# Altium schematic sheet Power_schematic.SchDoc
size 420 x 297 mm; SheetNumber: 1; SheetTotal: 4
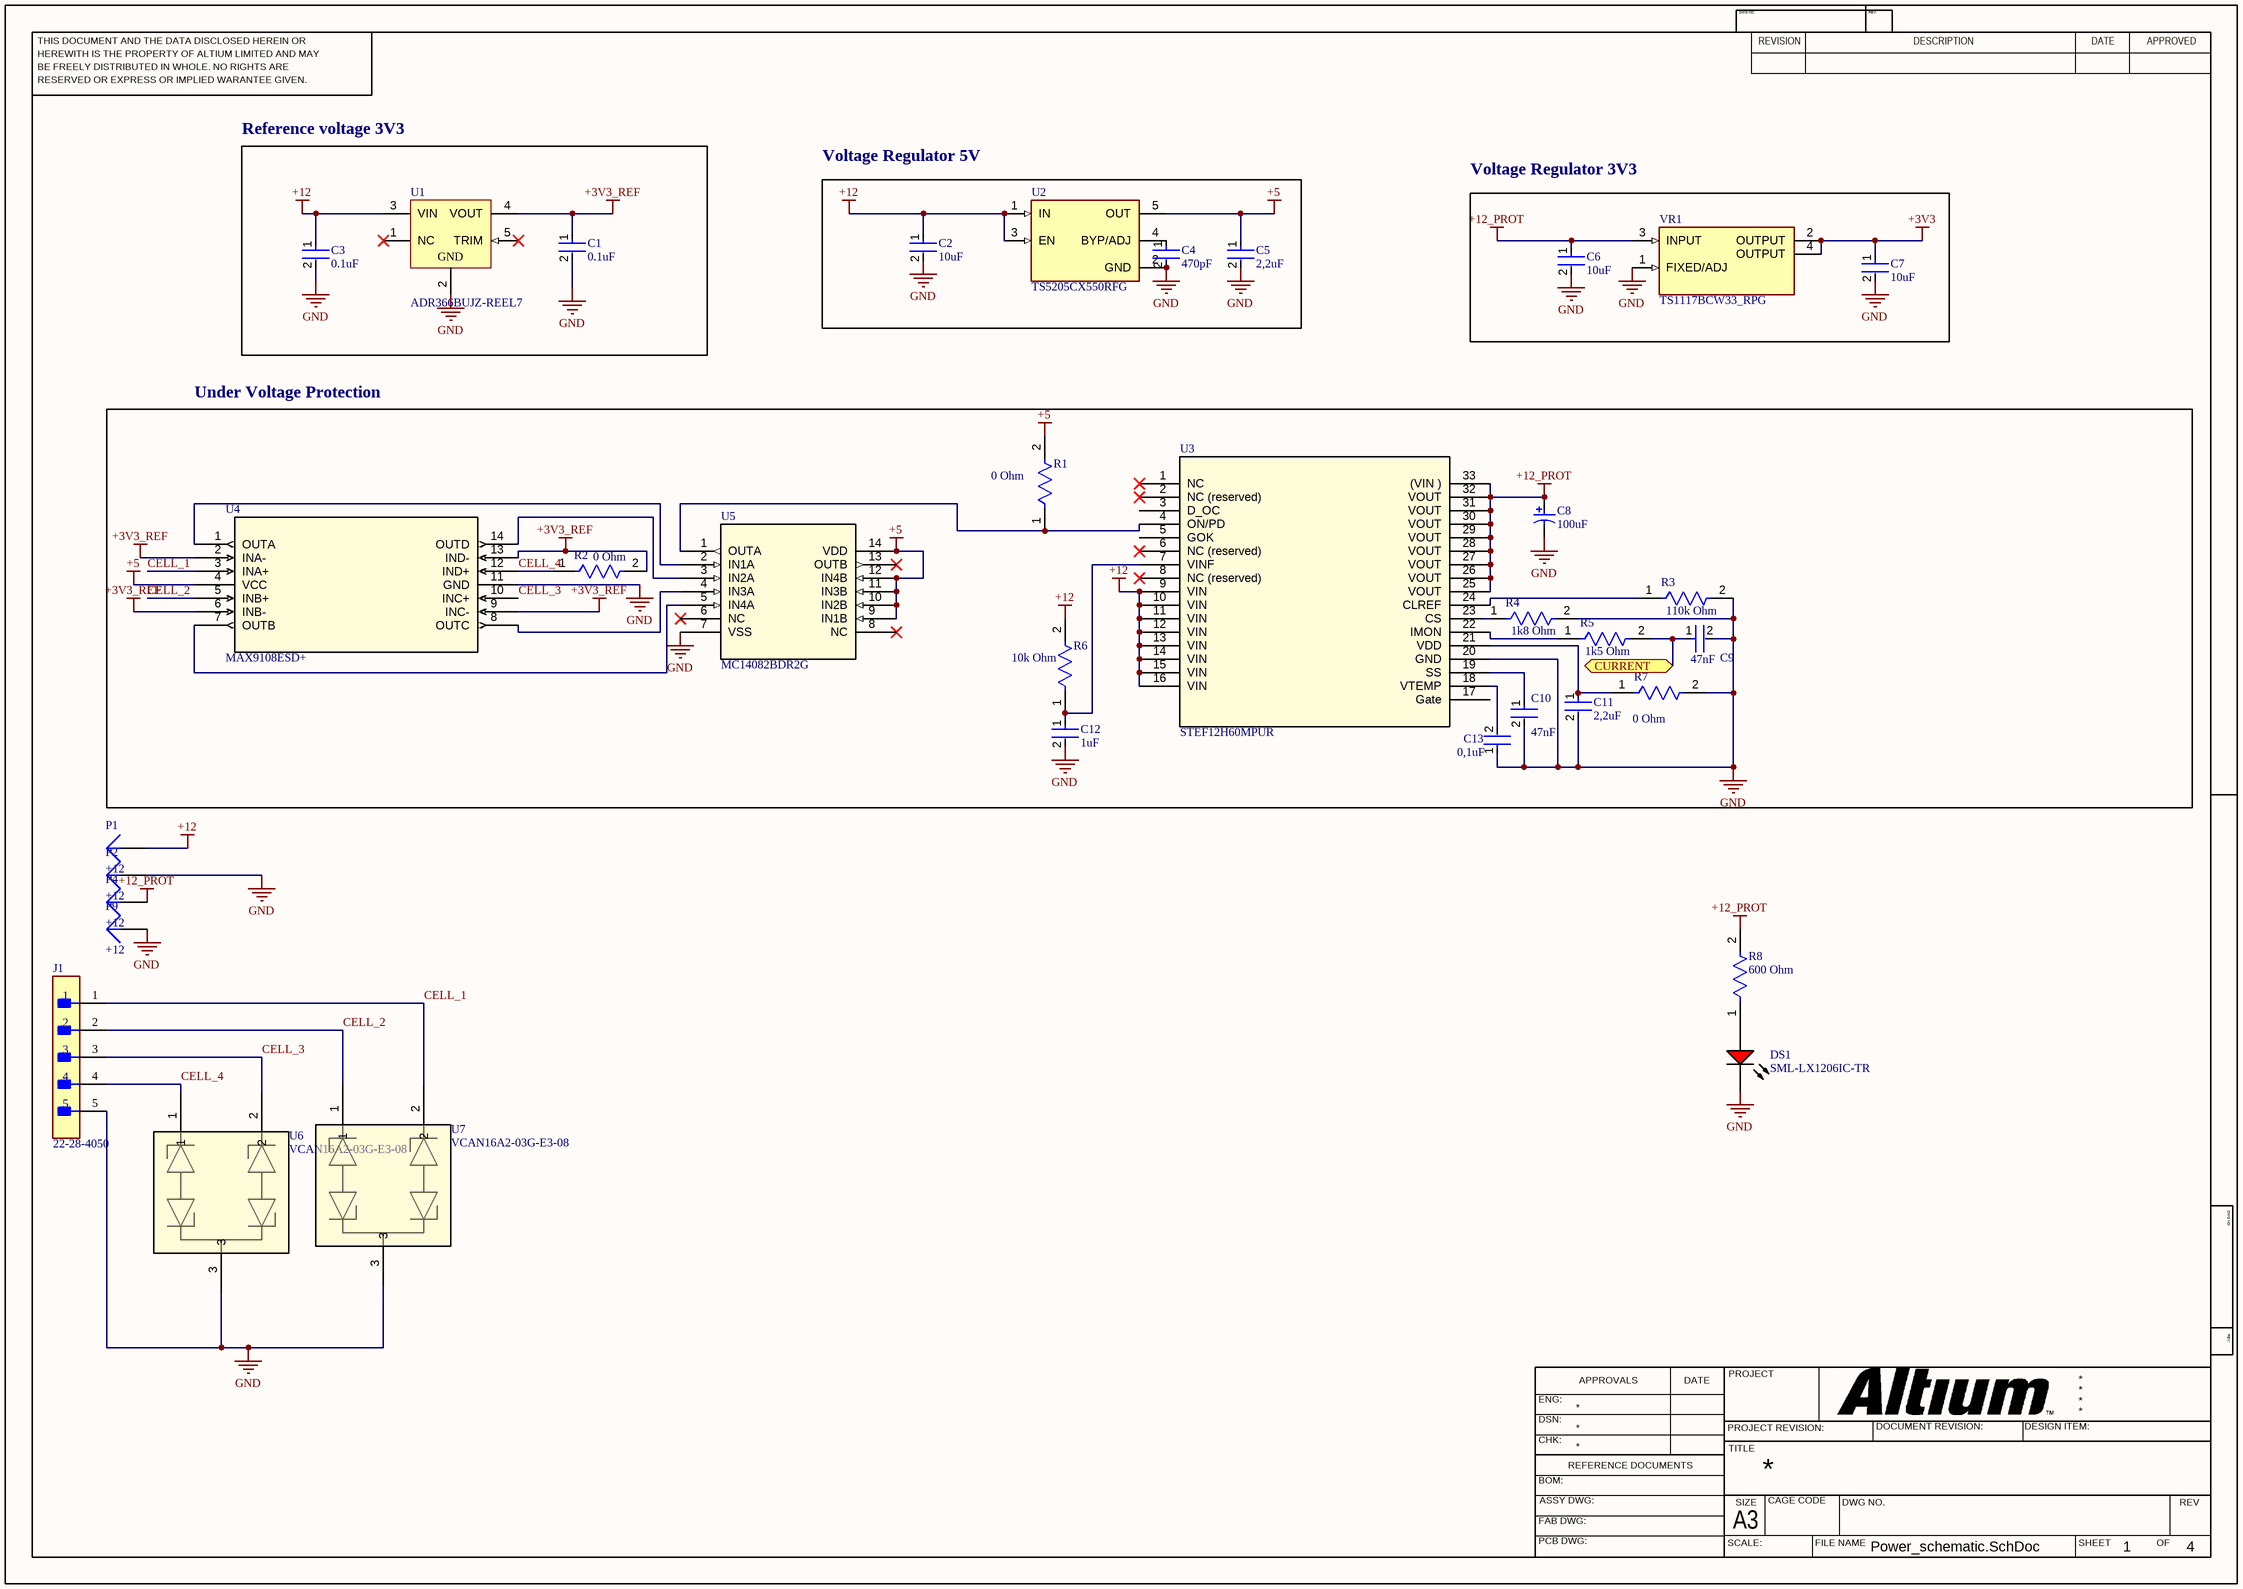
[diagram p0: Power_schematic.SchDoc]

## Parts
C1  0.1uF  [FP-CC0805-0_85-MFG]
C2  10uF  [FP-CC0805-0_85-MFG]
C3  0.1uF  [FP-CC0805-0_85-MFG]
C4  470pF  [FP-CC0805-0_85-MFG]
C5  2,2uF  [FP-CC0805-0_85-MFG]
C6  10uF  [FP-CC0805-0_85-MFG]
C7  10uF  [FP-CC0805-0_85-MFG]
C8  100uF  [PNSC-FK-V-D8_V]
C9  47nF  [FP-CC0805-0_85-MFG]
C10  47nF  [FP-CC0805-0_85-MFG]
C11  2,2uF  [FP-CC0805-0_85-MFG]
C12  1uF  [FP-CC0805-0_85-MFG]
C13  0,1uF  [FP-CC0805-0_85-MFG]
DS1  SML-LX1206IC-TR  [LUMX-SML-LX1206IC_V]
J1  22-28-4050  [FP-22-28-4050-MFG]
P1  +12  [PIN1]
P2  +12  [PIN1]
P4  +12  [PIN1]
P9  +12  [PIN1]
R1  0 Ohm  [FP-RMCF0805-MFG]
R2  0 Ohm  [FP-RMCF0805-MFG]
R3  110k Ohm  [FP-RMCF0805-MFG]
R4  1k8 Ohm  [FP-RMCF0805-MFG]
R5  1k5 Ohm  [FP-RMCF0805-MFG]
R6  10k Ohm  [FP-RMCF0805-MFG]
R7  0 Ohm  [FP-RMCF0805-MFG]
R8  600 Ohm  [FP-RMCF0805-MFG]
U1  ADR366BUJZ-REEL7  [ADI-UJ-5_L]
U2  TS5205CX550RFG  [SOT95P270X125-5N]
U3  STEF12H60MPUR  [QFN_60MPUR_STM]
U4  MAX9108ESD+  [21-0041B_14]
U5  MC14082BDR2G  [SOIC-14_NB_ONS]
U6  VCAN16A2-03G-E3-08  [SOT_3G-E3-08_VIS]
U7  VCAN16A2-03G-E3-08  [SOT_3G-E3-08_VIS]
VR1  TS1117BCW33_RPG  [VREG_TS1117BCW50_RPG]

## Blocks framed on the sheet
Reference voltage 3V3: C1 C3 U1

## Ports
CURRENT (bidir)

## Nets
+3V3: C7.1 VR1.2(OUTPUT) VR1.4(OUTPUT)
+3V3_REF: C1.1 R2.2 U1.4(VOUT) U4.2(INA-) U4.6(INB-) U4.9(INC-) U4.13(IND-)
+5: C5.1 R1.2 U2.5(OUT) U4.4(VCC) U5.9(IN1B) U5.10(IN2B) U5.11(IN3B) U5.12(IN4B) U5.14(VDD)
+12: C2.1 C3.1 P1.1 R6.2 U1.3(VIN) U2.1(IN) U2.3(EN) U3.9(VIN) U3.10(VIN) U3.11(VIN) U3.12(VIN) U3.13(VIN) U3.14(VIN) U3.15(VIN) U3.16(VIN)
+12_PROT: C6.1 C8.1 P4.1 R8.2 U3.25(VOUT) U3.26(VOUT) U3.27(VOUT) U3.28(VOUT) U3.29(VOUT) U3.30(VOUT) U3.31(VOUT) U3.32(VOUT) U3.33((VIN_)) VR1.3(INPUT)
GND: C1.2 C2.2 C3.2 C4.2 C5.2 C6.2 C7.2 C8.2 C9.2 C10.2 C11.2 C12.2 C13.1 DS1.2(K) J1.5 P2.1 P9.1 R3.2 R4.2 R7.2 U1.2(GND) U2.2(GND) U3.20(GND) U4.11(GND) U5.7(VSS) U6.3 U7.3 VR1.1(FIXED/ADJ)
CELL_1: J1.1 U4.3(INA+) U7.2
CELL_2: J1.2 U4.5(INB+) U7.1
CELL_3: J1.3 U4.10(INC+) U6.2
CELL_4: J1.4 R2.1 U4.12(IND+) U6.1
CURRENT: C9.1 R5.2 ; port CURRENT
NetC4_1: C4.1 U2.4(BYP/ADJ)
NetC10_1: C10.1 U3.19(SS)
NetC11_1: C11.1 R7.1 U3.21(VDD)
NetC12_1: C12.1 R6.1 U3.7(VINF)
NetC13_2: C13.2 U3.18(VTEMP)
NetDS1_1: DS1.1(A) R8.1
NetR1_1: R1.1 U3.4(ON/PD) U5.1(OUTA)
NetR3_1: R3.1 U3.24(CLREF)
NetR4_1: R4.1 U3.23(CS)
NetR5_1: R5.1 U3.22(IMON)
NetU4_1: U4.1(OUTA) U5.2(IN1A)
NetU4_7: U4.7(OUTB) U5.5(IN4A)
NetU4_8: U4.8(OUTC) U5.4(IN3A)
NetU4_14: U4.14(OUTD) U5.3(IN2A)

Not connected (* = marked no-connect by the designer): U1 1(NC)* 5(TRIM)*; U3 1(NC)* 2(NC_(reserved))* 3(D_OC) 5(GOK) 6(NC_(reserved))* 8(NC_(reserved))* 17(Gate); U5 6(NC)* 8(NC)* 13(OUTB)*

## Notes on the sheet
- Voltage Regulator 5V
- Voltage Regulator 3V3
- Under Voltage Protection
- THIS DOCUMENT AND THE DATA DISCLOSED HEREIN OR
- HEREWITH IS THE PROPERTY OF ALTIUM LIMITED AND MAY
- DWG NO:
- REVISION
- REV:
- DESCRIPTION
- DATE
- APPROVED
- BE FREELY DISTRIBUTED IN WHOLE. NO RIGHTS ARE
- RESERVED OR EXPRESS OR IMPLIED WARANTEE GIVEN.
- ENG:
- APPROVALS
- PROJECT
- DSN:
- CHK:
- REFERENCE DOCUMENTS
- PROJECT REVISION:
- TITLE
- DOCUMENT REVISION:
- DESIGN ITEM:
- BOM:
- FAB DWG:
- PCB DWG:
- ASSY DWG:
- SCALE:
- A3
- SIZE
- CAGE CODE
- FILE NAME
- DWG NO.
- SHEET
- OF
- REV

## Library data of the parts
C1-C7 C9-C13 = CMP-2100-03606-3: CAP CER 0.1UF 50V X7R 0805; Manufacturer Part Number: CC0805KRX7R9BB104; Manufacturer: Yageo; Tolerance: 0.1; Capacitance: 100 nF; Value: 100 nF; Material: Ceramic; Device Class L1: Passive Components; ComponentLink2Description: Datasheet; Package: CC0805-0.85; Digikey Description: CAP CER 0.1UF 50V X7R 0805; Device Class L3: Ceramic Capacitors; Temperature: -30°C to +85°C; Temperature Characteristic: X7R; Voltage Rating: 50 V; Height: 0.95mm; RoHS: TRUE; Ipc Land Pattern Name: CAPC200125X85; Device Class L2: Capacitors; Category: Cap; Temperature Range Low: -30°C; Temperature Range High: +85°C; Mouser Description: Multilayer Ceramic Capacitors MLCC - SMD/SMT 100nF 50V X7R 10%; Footprint Url: http://www.yageo.com/exep/pages/download/literatures/UPY-C_GEN_24.pdf; Automotive: No; Octopart: https://octopart.com/cc0805krx7r9bb104-yageo-192993; Lead Free: Yes; ComponentLink2URL: http://www.yageo.com/documents/recent/UPY-GPHC_Y5V_6.3V-to-50V_8.pdf
C8 = CMP-2000-06206-1: Aluminum Electrolytic Capacitor, 100 uF, +/- 20%, 25 V, 2-Pin SMD (Size Code D8), -55 to 105 degC, RoHS, Tape and Reel; Manufacturer: Panasonic; Type: Can; Lifetime@Temperature: 2000Hrs@105°C; Capacitance: 100µF; Rated Voltage: 25V; Ripple Current: 280mA; Impedance: 0.34O; Case Size/Dimension: Ø6.3x7.7mm; Operating Temp-Max: 105°C; Series: FK; Package URL: http://industrial.panasonic.com/cdbs/www-data/pdf/RDE0000/DME0000COL48.pdf; Mounting Technology: SurfaceMount; Package Description: 2-Pin Electrolytic Aluminum Capacitor, Body 6.6 x 6.6 mm; Datasheet Version: 03/2016; Datasheet URL: http://industrial.panasonic.com/cdbs/www-data/pdf/RDE0000/ABA0000C1181.pdf; Manufacturer URL: http://www.panasonic.com/; Package Reference: FK-V-D8; Operating Temp Range: -55to+105°C
DS1 = CMP-2000-07123-1: LED Red, 65 mW, -40 to 85 degC, 2-Pin SMD, RoHS, Tape and Reel; Manufacturer: Lumex; LED Material: GaAsP; Peak Wavelength: 635nm; Number of LEDs: 1; Viewing Angle: 160; Reverse Voltage: 5(Min)V; Lens Appearance: ColorlessNonDiffused; Intensity: 6mcd; Type: Uni-Color; Pin_Count: 2; Lens Dimensions: 2x1.6x0.5mm; Mounting: SurfaceMount; ECCN: EAR99; RoHS: Unknown; Package Description: 2-Pin Surface Mount Device, Body 3.2 x 1.5 mm; Mounting Technology: SurfaceMount; Dominant Wavelength: N/A; Supplier_Package: SMD; Supplier Standard Pack: 3,000; Color: Red; Dimension: 3.2x1.6x1.1mm; HTS: 8541402000; Part No: SML-LX1206IC-TR; Family: SML-LX1206IC; Supplier: Lumex; Datasheet URL: http://www.lumex.com/content/files/ProductAttachment/SML-LX1206IC-TR.pdf; Package Reference: SML-LX1206IC; Manufacturer URL: http://www.lumexinstruments.com/; Operating Temperature: -25to85C; Packaging: TapeandReel; Datasheet Version: Rev. J, 08/2012
J1 = CMP-00257-00278173-1: 22-28-4050 KK® 254 Breakaway Header, Vertical, 5 Circuits, Tin (Sn) Plating, Mating Pin Length 6.09mm; NexarPartId: 278173; Voltage Rating: 250V; Number of Contacts: 5; Contact Resistance: 20mΩ; Gender: Male; Pitch: 2.54mm; Connector Type: Male Pin; Current Rating: 4A; Glow Wire Compliant: Non-compliant; Max Voltage Rating (DC): 250.25kV; Flammability Rating: UL94 V-0; Min Operating Temperature: 0°C; REACH SVHC: Unknown; Lead Free: Lead Free; Termination: Solder; RoHS: Compliant; Schedule B: 8536694040; Number of Circuits: 5; Mount: Through Hole; Lead Pitch: 2.54mm; Height: 2.29mm; Voltage Rating (DC): 250V; Max Operating Temperature: 75°C; Width: 2.49mm; Radiation Hardening: No; Contact Plating: Tin; Orientation: Vertical; Length: 12.7mm; Number of Rows: 1; Housing Material: Thermoplastic; Contact Material: Brass; Packaging: Bulk; Contact Mating Length: 6.096mm; Housing Color: Black; Color: Black; Number of Positions: 5
P1 P2 P4 P9 = Plug: LatestRevisionDate: 17-Jul-2002; LatestRevisionNote: Re-released for DXP Platform.; Publisher: Altium Limited
R1-R8 = CMP-26527-000017-1: RES 0 OHM JUMPER 1/8W 0805; Power Rating: 125mW; Resistance: 0mR; Depth: 1.25mm; Length: 2mm; Military Standard: Not; Width: 0.049inch; Case Code (Imperial): 0805; Number of Terminations: 2; Mount: Surface Mount; Contact Plating: Tin; Height: 0.026inch; Case/Package: 0805; Min Operating Temperature: -55°C; Composition: Thick Film; Max Operating Temperature: 155°C; Packaging: Tape and Reel; Features: Automotive AEC-Q200; Max Power Dissipation: 125mW; Radiation Hardening: No; Lead Free: Lead Free; Case Code (Metric): 2012
U1 = CMP-0784-00515-1: Low Power, Low Noise Voltage Reference with Sink / Source Capability, 3.3 V Output, 3.6 to 15 V Supply, Industrial, 5-pin SOT23 (UJ-5), Reel; Manufacturer: Analog Devices; Max V Supply (V): 15; Min V Supply (V): 3.6; Automotive Qualified: Yes; Ref Out TC (ppm/C): 9; Vout: 3.3V; ComponentLink1Description: Manufacturer URL; Operating Temp Range: -40 to 125 degC; ComponentLink4Description: URL Link1; Code_JEDEC: MO-193-AB; PackageDescription: 5-Pin Thin Small Outline Transistor Package, Body 2.9 x 1.6 mm, Pitch 0.95 mm; PackageVersion: 100708-A, 10/2008; DatasheetVersion: Rev. D; ComponentLink3Description: Package Specification; ComponentLink1URL: http://www.analog.com/en/index.html; ComponentLink3URL: http:/www.analog.com/static/imported-files/packages/PKG_PDF/TSOT(UJ)/UJ_5.pdf; ComponentLink4URL: Product URL:http://www.analog.com/en/special-linear-functions/voltage-references/adr366/products/product.html; ComponentLink2Description: Datasheet; Packing: Reel; ComponentLink2URL: http://www.analog.com/static/imported-files/data_sheets/ADR360_361_363_364_365_366.pdf; Mounting Technology: Surface Mount; PartNumber: ADR366BUJZ-REEL7; PackageReference: UJ-5
U2 = TS5205CX550RFG: MF: {'manufacturer': u'Taiwan Semiconductor Corporation'}; Package: None; Price: None; Value: *; MP: TS5205CX550RFG; Availability: Unavailable
U3 = STEF12H60MPUR: No Description Available; Mfr_Name: STMicroelectronics; RefDes: RefDes; Type: Type
U4 = MAX9108ESD+: No Description Available; Mfr_Name: Analog Devices / Maxim Integrated; RefDes: RefDes; Type: Type
U5 = MC14082BDR2G: No Description Available; Mfr_Name: onsemi; RefDes: RefDes; Type: Type
U6 U7 = VCAN16A2-03G-E3-08: No Description Available; Mfr_Name: Vishay; RefDes: RefDes; Type: Type
VR1 = TS1117BCW50_RPG: Package: None; Price: None; Value: *; MP: TS1117BCW50_RPG; Availability: Unavailable